# Altium schematic sheet SC945D_Sommaire.SchDoc: Informations Carte
size 393 x 270 mm; CompanyName: Seccom; Address1: 521, rue du capt. François Garbit; Address2: 69440 Mornant; Address3: seccom@seccom.fr; Address4: www.seccom.fr; DocumentNumber: 1; SheetNumber: 1; SheetTotal: 9; PageSetup: Record=PageOptions|CenterHorizontal=True|CenterVertical=True|PrintScale=0.74|XCorrection=1.00|YCorrection=1.00|PrintKind=0|BorderSize=5000000|LeftOffset=0|BottomOffset=0|Orientation=2|PaperLength=1000|PaperWidth=1000|Scale=100|PaperSource=7|PrintQuality=-4|MediaType=1|DitherType=10|PaperKind=A4|PrintScaleMode=1
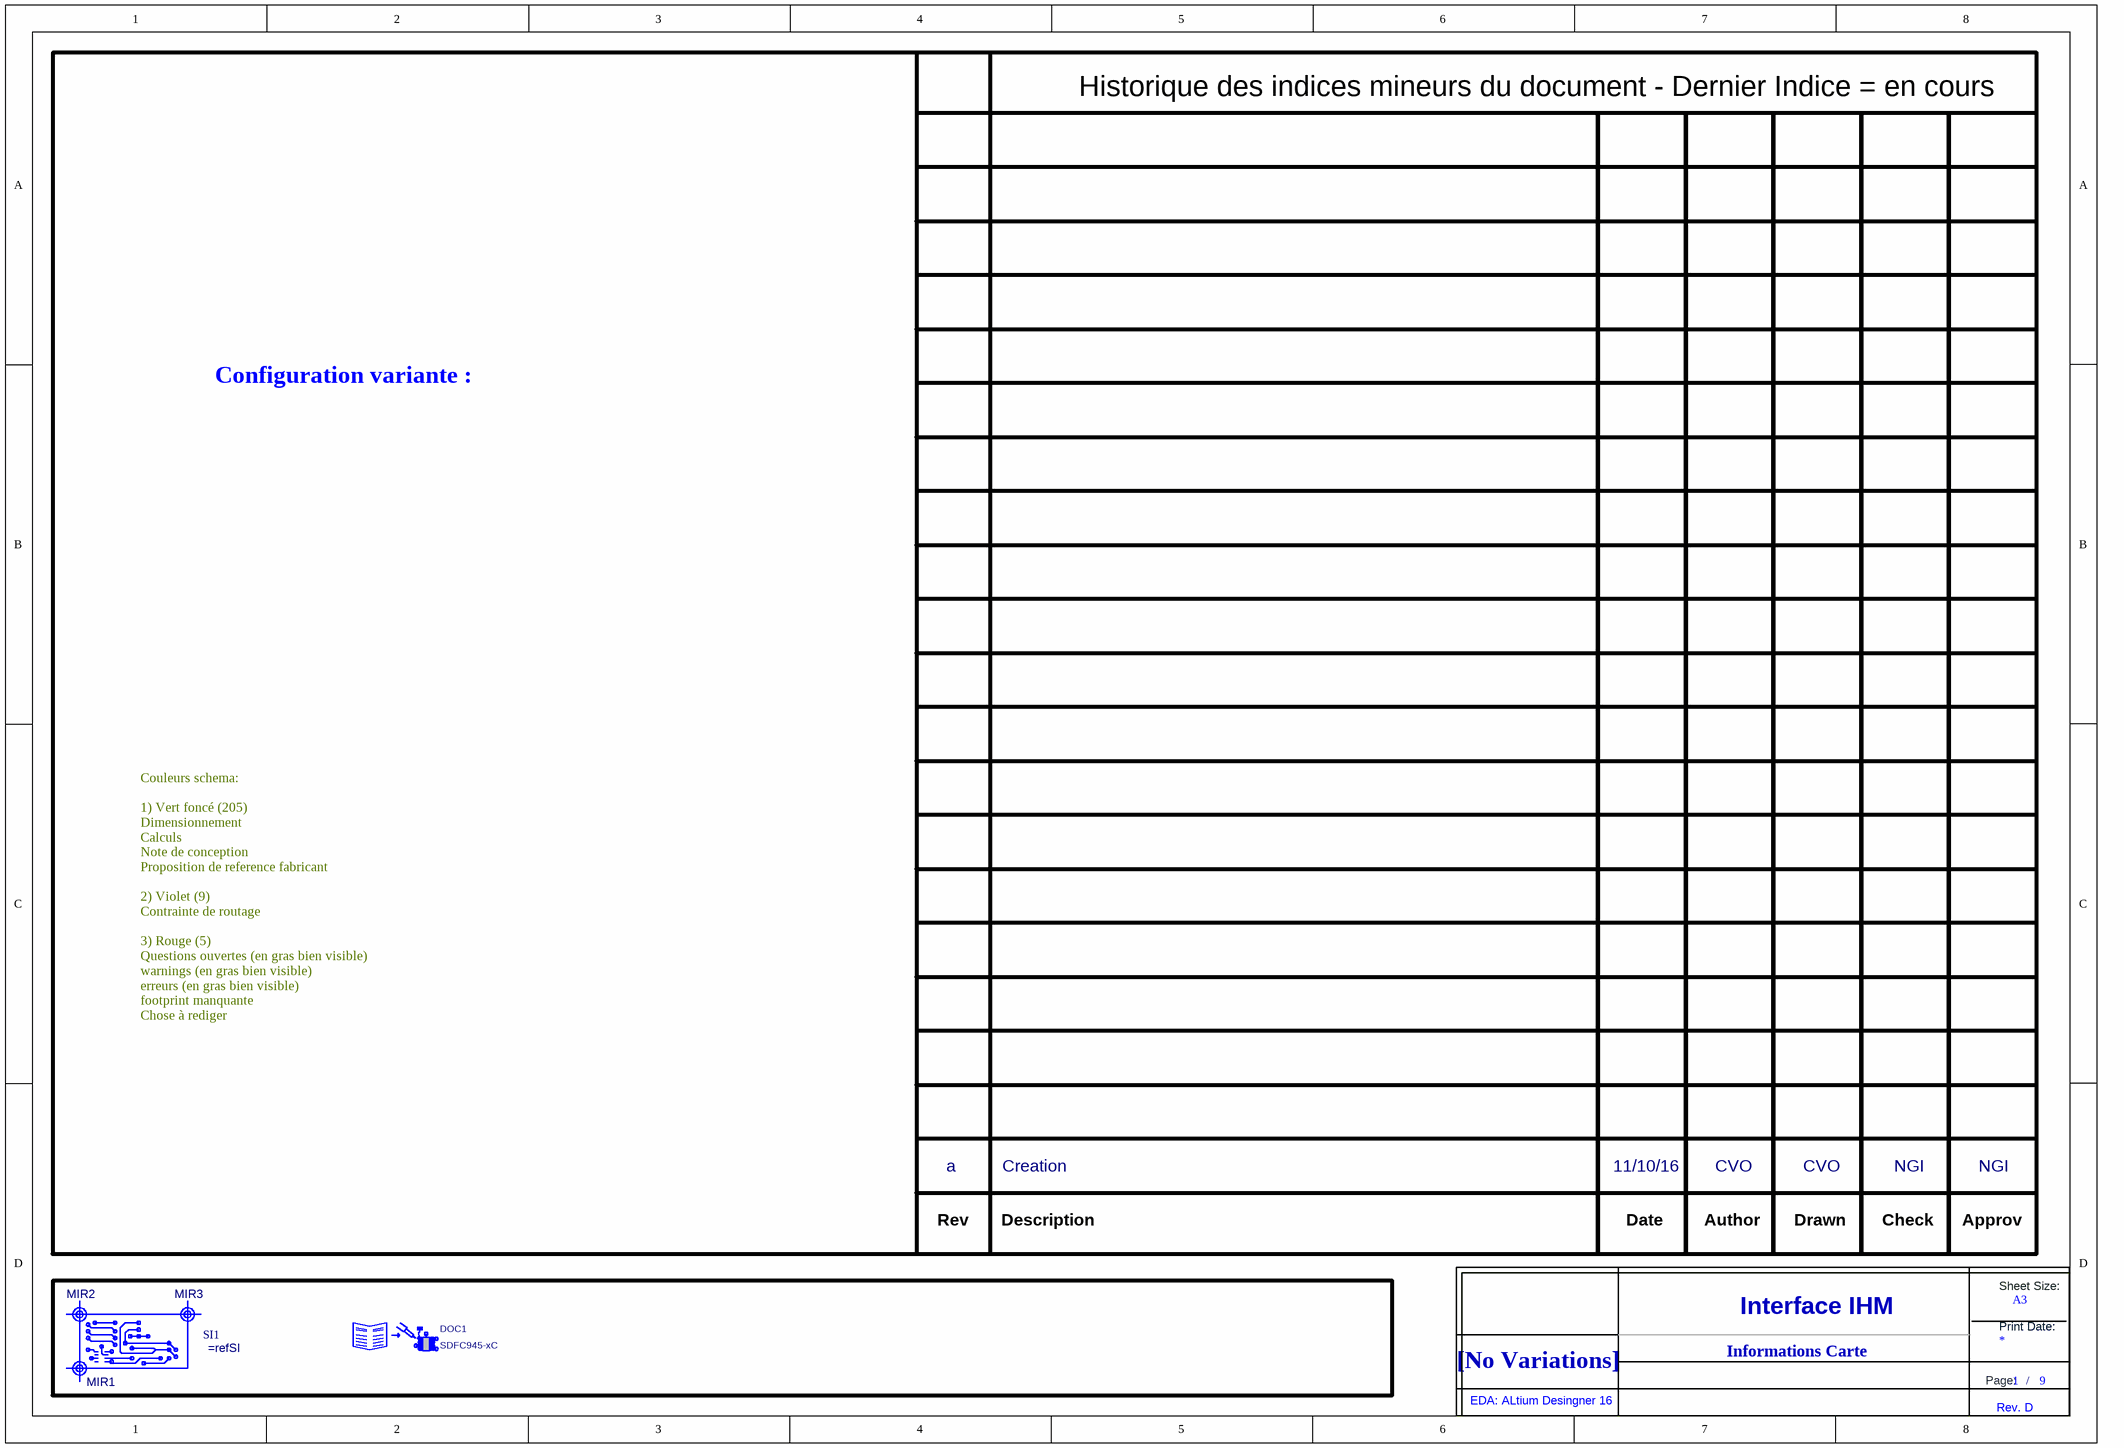
[diagram p0: SC945D_Sommaire.SchDoc]

## Parts
DOC1  Reference: SDFC945-xC  [NULL]  (hidden comment: DOCUMENT_FAB_CARTE_SDFC)
MIR1  MIRE_PICK-N-PLACE  [MIRE_PICK-N-PLACE_D1MM_VE3MM]  (value not drawn)
MIR2  MIRE_PICK-N-PLACE  [MIRE_PICK-N-PLACE_D1MM_VE3MM]  (value not drawn)
MIR3  MIRE_PICK-N-PLACE  [MIRE_PICK-N-PLACE_D1MM_VE3MM]  (value not drawn)
SI1  (no value)  [CIRCUIT_IMPRIME_SI_STD]
Title_new?  DNI  (value not drawn)  (graphical)

## Notes on the sheet
- Historique des indices mineurs du document - Dernier Indice = en cours
- Configuration variante :
- Couleurs schema:
  1) Vert foncé (205)
  Dimensionnement
  Calculs
  Note de conception
  Proposition de reference fabricant
  2) Violet (9)
  Contrainte de routage
  3) Rouge (5)
  Questions ouvertes (en gras bien visible)
  warnings (en gras bien visible)
  erreurs (en gras bien visible)
  footprint manquante
  Chose à rediger
- a
- Creation
- 11/10/16
- CVO
- NGI
- Rev
- Description
- Date
- Author
- Drawn
- Check
- Approv
- Informations Carte
- (in symbol Title_new) Sheet Size:; A3; Interface IHM; Print Date:; [No Variations]; Page:; /; EDA: ALtium Desingner 16; Rev. D

## Library data of the parts
DOC1 = DOCUMENT_FAB_CARTE_SDFC: Document de Fabrication pour la Carte SC{Num SC}-{Version SC}; Creation: LJ; Coeff: 0; Verification: *; Boitier: *; Fabricant: *; Ref Fab: *; Config: *; ComponentLink1URL: http://192.168.0.202/index.php/Accueil; ComponentLink2URL: http://192.168.0.202/index.php/Accueil; ComponentLink1Description: Datasheet; ComponentLink2Description: Datasheet Boitier
MIR1-MIR3 = MIRE_PICK-N-PLACE: Mire pour machine de placement CMS "Pick'n Place"; Creation: LJ (25/10/12); Config: NC; Coeff: 0; Value: *
SI1 = CIRCUIT_IMPRIME_MODEL: Circuit Imprimé; Value: SI945D; Creation: LJ; Verification: LJ (15/11/04); Remarque: {Remarque}; Fabricant: Valentinea; Coeff: 1; Boitier: *; Ref Fab: =refSI; ComponentLink1URL: \\SRV_backup\datasheet\; ComponentLink2URL: \\SRV_backup\datasheet\_BOITIERS\; Config: *; ComponentLink1Description: Datasheet; ComponentLink2Description: Datasheet Boitier; Reference: =refSI
Title_new? = Title_new